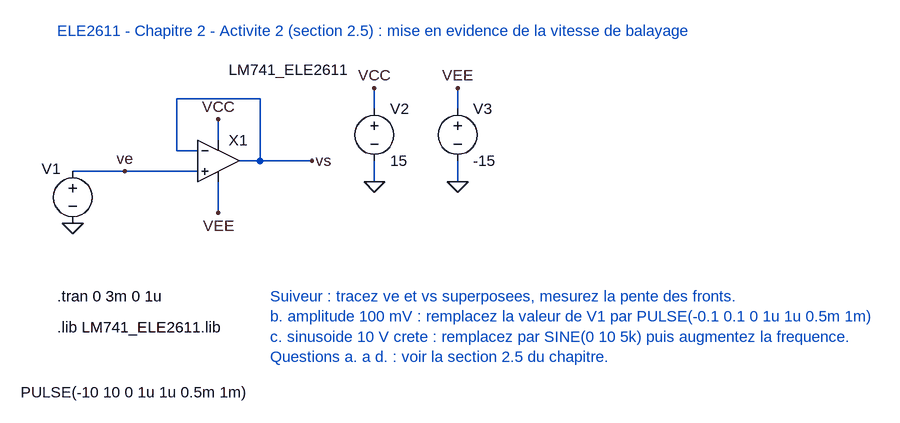
[diagram p0: schematic Ch2_Act2_SlewRate.asc]
Ch2_Act2_SlewRate.asc, the LTspice schematic file:
Version 4
SHEET 1 1200 700
WIRE 96 256 176 256
WIRE 176 256 288 256
WIRE 352 240 384 240
WIRE 384 144 384 240
WIRE 256 144 384 144
WIRE 256 144 256 224
WIRE 256 224 288 224
WIRE 384 240 464 240
WIRE 320 176 320 208
WIRE 320 272 320 320
WIRE 560 128 560 160
WIRE 560 240 560 272
WIRE 688 128 688 160
WIRE 688 240 688 272
FLAG 96 336 0
FLAG 176 256 ve
FLAG 320 176 VCC
FLAG 320 320 VEE
FLAG 464 240 vs
FLAG 560 128 VCC
FLAG 560 272 0
FLAG 688 128 VEE
FLAG 688 272 0
SYMBOL voltage 96 240 R0
WINDOW 0 -48 12 Left 2
WINDOW 3 -80 356 Left 2
SYMATTR InstName V1
SYMATTR Value PULSE(-10 10 0 1u 1u 0.5m 1m)
SYMBOL Opamps\\opamp2 320 176 R0
WINDOW 3 16 -76 Left 2
SYMATTR InstName X1
SYMATTR Value LM741_ELE2611
SYMBOL voltage 560 144 R0
SYMATTR InstName V2
SYMATTR Value 15
SYMBOL voltage 688 144 R0
SYMATTR InstName V3
SYMATTR Value -15
TEXT 72 40 Left 2 ;ELE2611 - Chapitre 2 - Activite 2 (section 2.5) : mise en evidence de la vitesse de balayage
TEXT 72 448 Left 2 !.tran 0 3m 0 1u
TEXT 72 496 Left 2 !.lib LM741_ELE2611.lib
TEXT 400 448 Left 2 ;Suiveur : tracez ve et vs superposees, mesurez la pente des fronts.\nb. amplitude 100 mV : remplacez la valeur de V1 par PULSE(-0.1 0.1 0 1u 1u 0.5m 1m)\nc. sinusoide 10 V crete : remplacez par SINE(0 10 5k) puis augmentez la frequence.\nQuestions a. a d. : voir la section 2.5 du chapitre.

The netlist it stands for:
* Ch2_Act2_SlewRate.asc
V1 ve 0 PULSE(-10 10 0 1u 1u 0.5m 1m)
XX1 ve vs VCC VEE vs LM741_ELE2611  ; pins In+ In- V+ V- OUT
V2 VCC 0 15
V3 VEE 0 -15
* ELE2611 - Chapitre 2 - Activite 2 (section 2.5) : mise en evidence de la vitesse de balayage
.tran 0 3m 0 1u
.lib LM741_ELE2611.lib
* Suiveur : tracez ve et vs superposees, mesurez la pente des fronts.
* b. amplitude 100 mV : remplacez la valeur de V1 par PULSE(-0.1 0.1 0 1u 1u 0.5m 1m)
* c. sinusoide 10 V crete : remplacez par SINE(0 10 5k) puis augmentez la frequence.
* Questions a. a d. : voir la section 2.5 du chapitre.
.backanno
.end